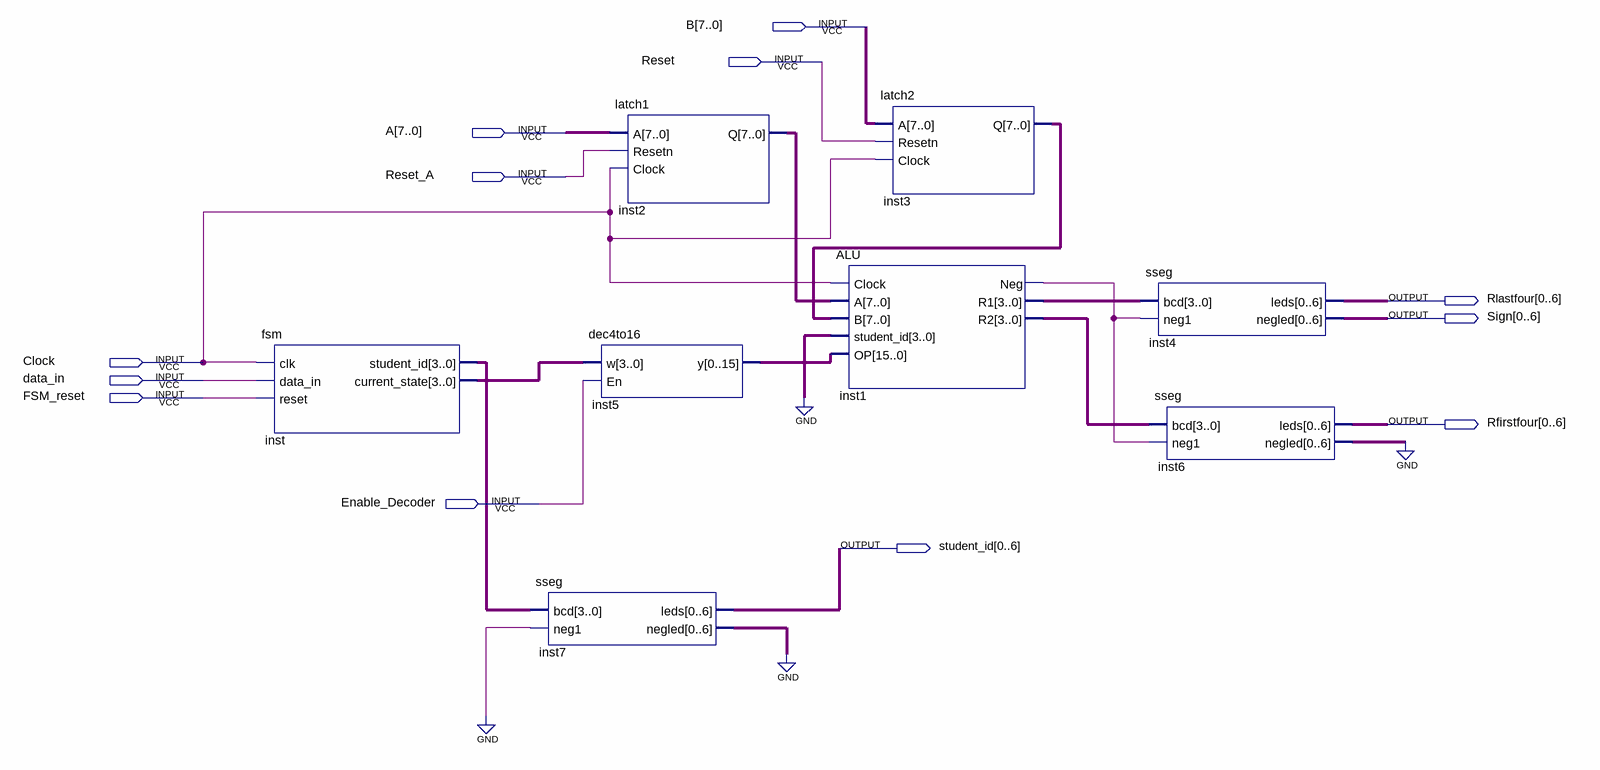
[diagram p0: schematic sheet]
// Quartus schematic gpu.bdf as structural Verilog: 8 symbols, 12 pins
module gpu (
  input  [7:0] B,
  input  Reset,
  input  [7:0] A,
  input  Reset_A,
  input  Clock,
  input  data_in,
  input  FSM_reset,
  input  Enable_Decoder,
  output [0:6] Rlastfour,
  output [0:6] Sign,
  output [0:6] Rfirstfour,
  output [0:6] student_id
);

  wire inst1_neg;
  wire [3:0] inst1_r1, inst1_r2, inst_current_state, inst_student_id;
  wire [6:0] inst6_negled, inst7_negled;
  wire [7:0] inst2_q, inst3_q;
  wire [15:0] inst5_y;

  fsm inst (
    .clk(Clock), .data_in(data_in), .reset(FSM_reset), .student_id(inst_student_id),
    .current_state(inst_current_state));
  dec4to16 inst5 (.w(inst_current_state), .En(Enable_Decoder), .y(inst5_y));
  sseg inst7 (.bcd(inst_student_id), .neg1(1'b0), .leds(student_id), .negled(inst7_negled));
  latch1 inst2 (.A(A), .Resetn(Reset_A), .Clock(Clock), .Q(inst2_q));
  latch2 inst3 (.A(B), .Resetn(Reset), .Clock(Clock), .Q(inst3_q));
  ALU inst1 (
    .Clock(Clock), .A(inst2_q), .B(inst3_q), .student_id(4'b0000), .OP(inst5_y), .Neg(inst1_neg),
    .R1(inst1_r1), .R2(inst1_r2));
  sseg inst4 (.bcd(inst1_r1), .neg1(inst1_neg), .leds(Rlastfour), .negled(Sign));
  sseg inst6 (.bcd(inst1_r2), .neg1(inst1_neg), .leds(Rfirstfour), .negled(inst6_negled));
  // also tied to GND on the sheet: {inst7_negled[0], inst7_negled[1], inst7_negled[2], inst7_negled[3], inst7_negled[4], inst7_negled[5], inst7_negled[6], inst6_negled[0], inst6_negled[1], inst6_negled[2], inst6_negled[3], inst6_negled[4], inst6_negled[5], inst6_negled[6]}
endmodule
